# EAGLE schematic WiazkaLewaRekojesc (EAGLE 8.6.0)
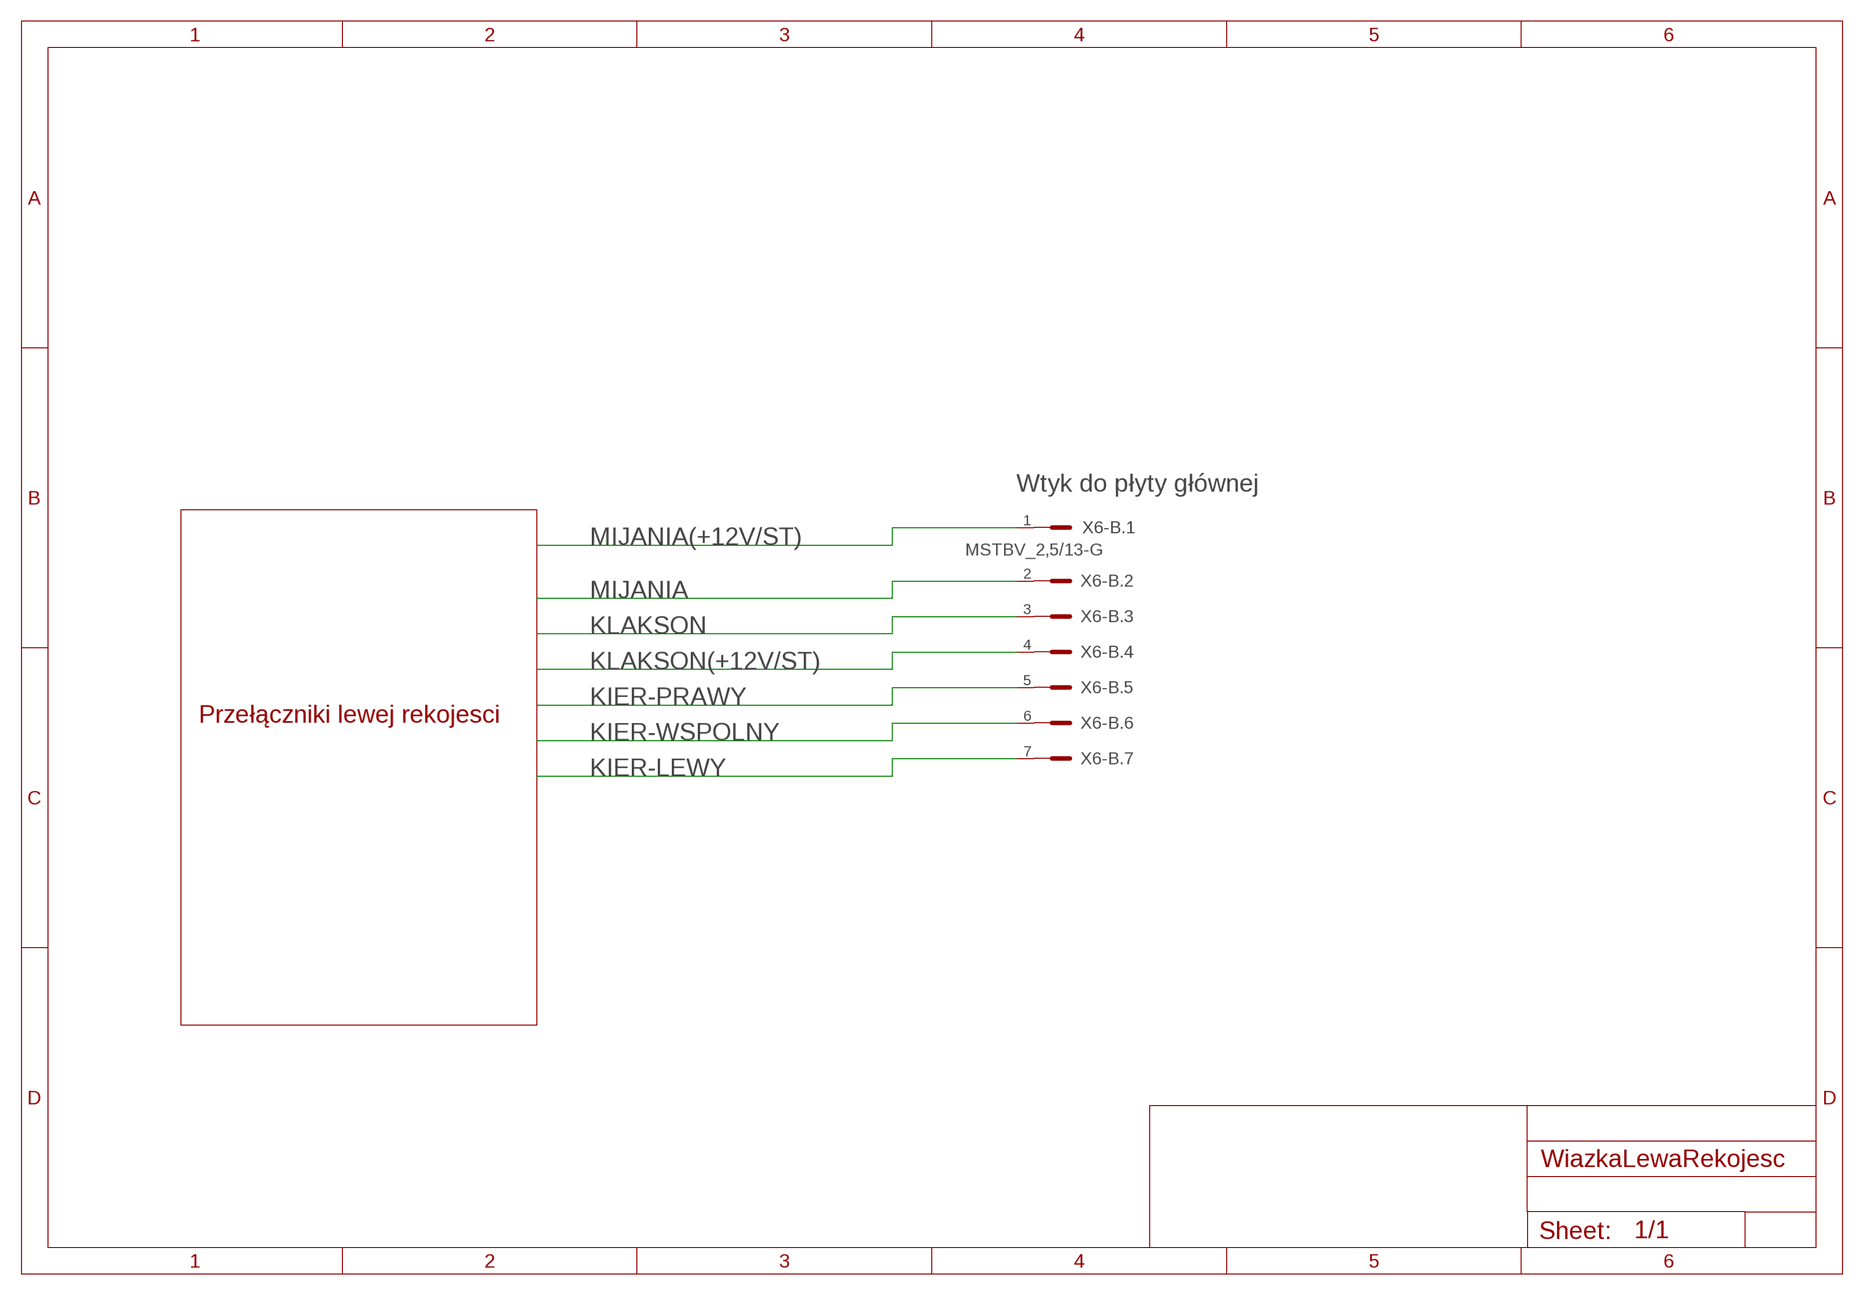
[diagram p0: schematic, sheet 1]

## Parts
X6-B  MSTBV_2,5/13-G  [MSTBV_2,5/13-G]

## Nets
KIER-LEWY: X6-B.7
KIER-PRAWY: X6-B.5
KIER-WSPOLNY: X6-B.6
KLAKSON: X6-B.3
KLAKSON(+12V/ST): X6-B.4
MIJANIA: X6-B.2
MIJANIA(+12V/ST): X6-B.1
Unconnected: X6-B.8 X6-B.9 X6-B.10 X6-B.11 X6-B.12 X6-B.13

## Notes on the sheet
- Wtyk do płyty głównej
- Przełączniki lewej rekojesci

## Library data of the parts
X6-B = con-phoenix-500:MSTBV_2,5/13-G: Grundleiste - MSTBV 2,5/13-G - 1753657 Grundgehäuse, Nennstrom: 12 A Bemessungsspannung (III/2): 320 V Polzahl: 13 Rastermaß: 5 mm Farbe: grün Kontaktoberfläche: Zinn Montage: Löten